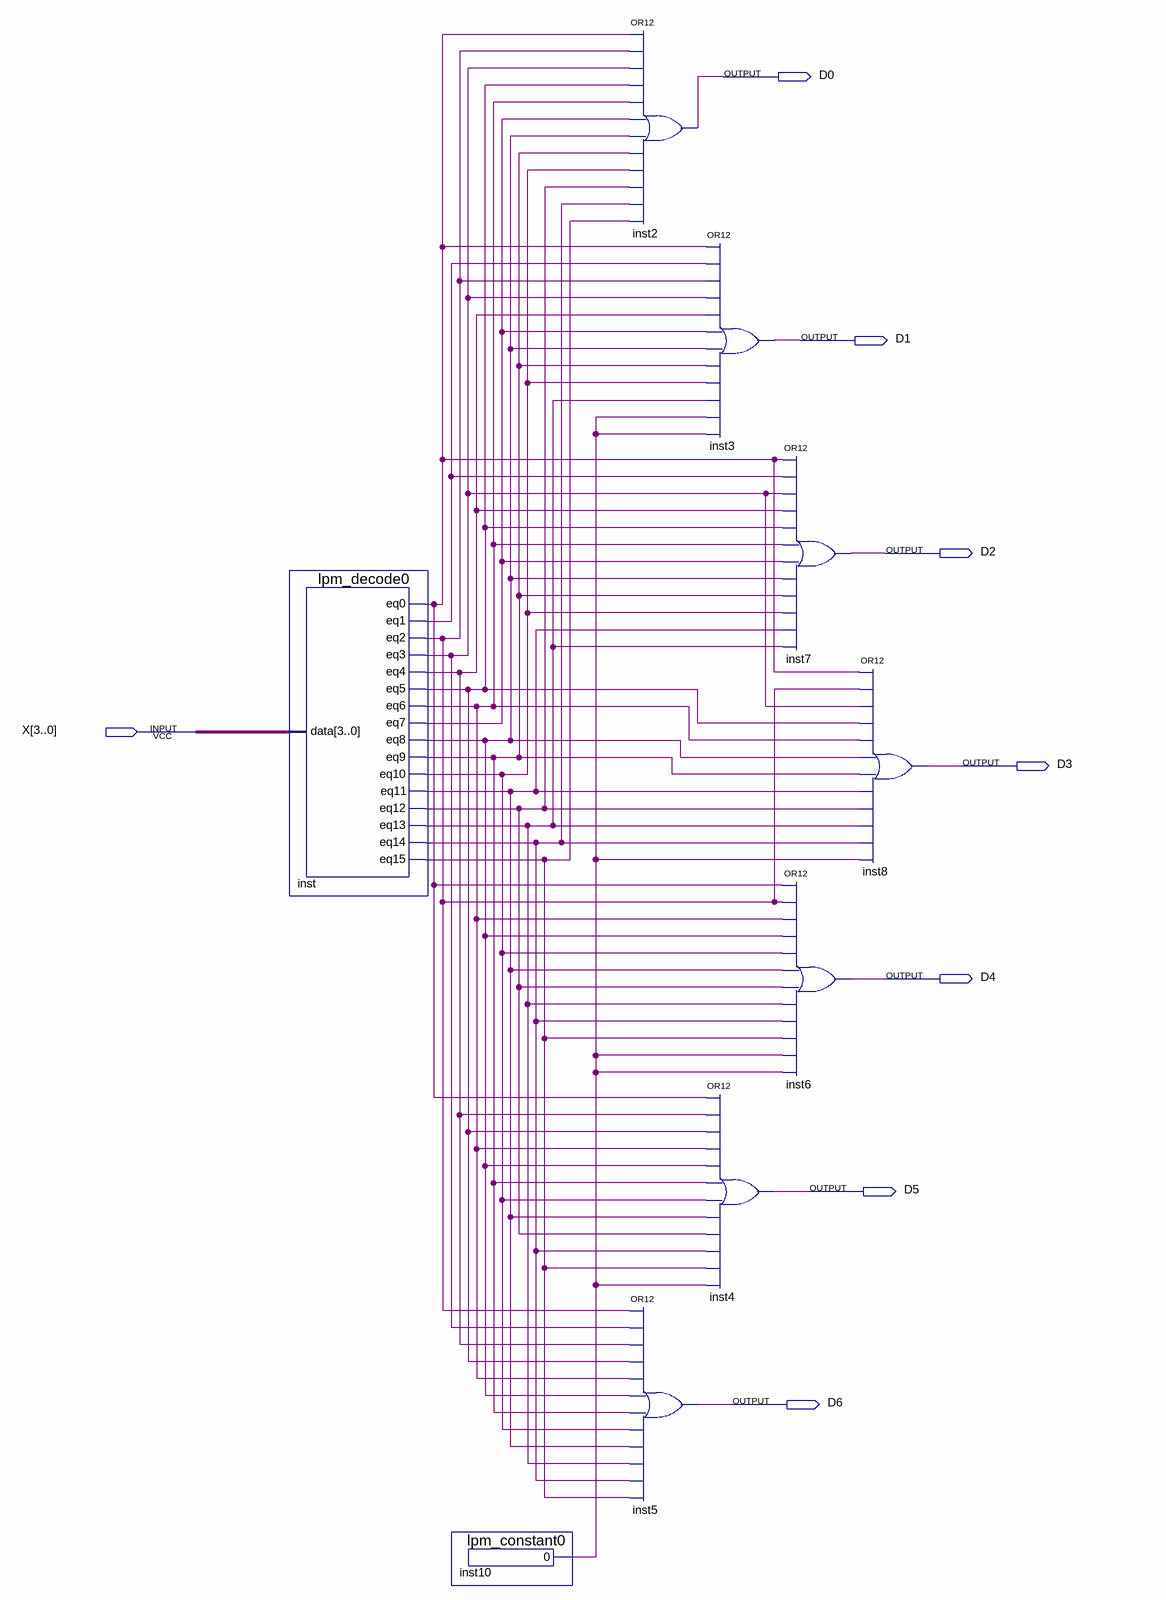
[diagram p0: schematic sheet]
// Quartus schematic lab02_2.bdf as structural Verilog: 9 symbols, 8 pins
module lab02_2 (
  input  [3:0] X,
  output D0,
  output D1,
  output D2,
  output D3,
  output D4,
  output D5,
  output D6
);

  wire inst10_result, inst_eq0, inst_eq1, inst_eq2, inst_eq3, inst_eq4, inst_eq5, inst_eq6, inst_eq7,
       inst_eq8, inst_eq9, inst_eq10, inst_eq11, inst_eq12, inst_eq13, inst_eq14, inst_eq15;

  lpm_decode0 inst (
    .data(X), .eq0(inst_eq0), .eq1(inst_eq1), .eq2(inst_eq2), .eq3(inst_eq3), .eq4(inst_eq4), .eq5(inst_eq5),
    .eq6(inst_eq6), .eq7(inst_eq7), .eq8(inst_eq8), .eq9(inst_eq9), .eq10(inst_eq10), .eq11(inst_eq11),
    .eq12(inst_eq12), .eq13(inst_eq13), .eq14(inst_eq14), .eq15(inst_eq15));
  lpm_constant0 inst10 (.result(inst10_result));
  or inst2 (D0, inst_eq0, inst_eq2, inst_eq3, inst_eq5, inst_eq6, inst_eq7, inst_eq8, inst_eq9, inst_eq10, inst_eq12, inst_eq14, inst_eq15);
  or inst5 (D6, inst_eq2, inst_eq3, inst_eq4, inst_eq5, inst_eq6, inst_eq8, inst_eq9, inst_eq10, inst_eq11, inst_eq13, inst_eq14, inst_eq15);
  or inst3 (D1, inst_eq0, inst_eq1, inst_eq2, inst_eq3, inst_eq4, inst_eq7, inst_eq8, inst_eq9, inst_eq10, inst_eq13, inst10_result, inst10_result);
  or inst4 (D5, inst_eq0, inst_eq4, inst_eq5, inst_eq6, inst_eq8, inst_eq9, inst_eq10, inst_eq11, inst_eq12, inst_eq14, inst_eq15, inst10_result);
  or inst7 (D2, inst_eq0, inst_eq1, inst_eq3, inst_eq4, inst_eq5, inst_eq6, inst_eq7, inst_eq8, inst_eq9, inst_eq10, inst_eq11, inst_eq13);
  or inst6 (D4, inst_eq0, inst_eq2, inst_eq6, inst_eq8, inst_eq10, inst_eq11, inst_eq12, inst_eq13, inst_eq14, inst_eq15, inst10_result, inst10_result);
  or inst8 (D3, inst_eq0, inst_eq2, inst_eq3, inst_eq5, inst_eq6, inst_eq8, inst_eq9, inst_eq11, inst_eq12, inst_eq13, inst_eq14, inst10_result);
endmodule
